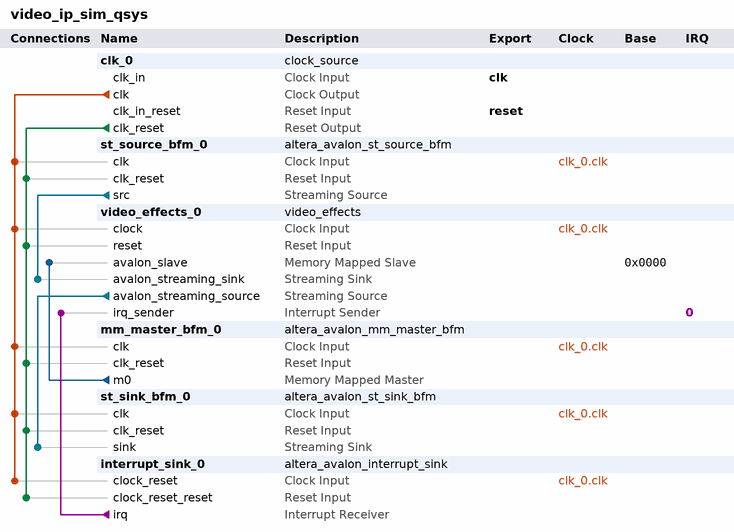
[diagram p0: system contents]
# Platform Designer (Qsys) system video_ip_sim_qsys, Cyclone IV E EP4CE115F29C7
# Parameters at their usual value, and those the tool derives, are not listed.
package require -exact qsys 17.1
create_system video_ip_sim_qsys
set_project_property DEVICE_FAMILY {Cyclone IV E}
set_project_property DEVICE EP4CE115F29C7

add_instance clk_0 clock_source 17.1
set_instance_parameter_value clk_0 clockFrequency 50000000

add_instance st_source_bfm_0 altera_avalon_st_source_bfm 17.1
set_instance_parameter_value st_source_bfm_0 ST_CHANNEL_W 1
set_instance_parameter_value st_source_bfm_0 ST_ERROR_W 1
set_instance_parameter_value st_source_bfm_0 ST_MAX_CHANNELS 0
set_instance_parameter_value st_source_bfm_0 ST_NUMSYMBOLS 1
set_instance_parameter_value st_source_bfm_0 ST_SYMBOL_W 16
set_instance_parameter_value st_source_bfm_0 USE_CHANNEL 0
set_instance_parameter_value st_source_bfm_0 USE_EMPTY 0
set_instance_parameter_value st_source_bfm_0 USE_ERROR 0
set_instance_parameter_value st_source_bfm_0 USE_PACKET 1
set_instance_parameter_value st_source_bfm_0 USE_READY 1
set_instance_parameter_value st_source_bfm_0 USE_VALID 1

add_instance video_effects_0 video_effects 0

add_instance mm_master_bfm_0 altera_avalon_mm_master_bfm 17.1
set_instance_parameter_value mm_master_bfm_0 ADDRESS_UNITS WORDS
set_instance_parameter_value mm_master_bfm_0 AV_ADDRESS_W 3
set_instance_parameter_value mm_master_bfm_0 AV_ALWAYS_BURST_MAX_BURST 0
set_instance_parameter_value mm_master_bfm_0 AV_BURSTCOUNT_W 1
set_instance_parameter_value mm_master_bfm_0 AV_BURST_BNDR_ONLY 0
set_instance_parameter_value mm_master_bfm_0 AV_BURST_LINEWRAP 0
set_instance_parameter_value mm_master_bfm_0 AV_CONSTANT_BURST_BEHAVIOR 0
set_instance_parameter_value mm_master_bfm_0 AV_FIX_READ_LATENCY 0
set_instance_parameter_value mm_master_bfm_0 AV_MAX_PENDING_WRITES 0
set_instance_parameter_value mm_master_bfm_0 AV_NUMSYMBOLS 4
set_instance_parameter_value mm_master_bfm_0 AV_READRESPONSE_W 8
set_instance_parameter_value mm_master_bfm_0 AV_READ_WAIT_TIME 1
set_instance_parameter_value mm_master_bfm_0 AV_WRITERESPONSE_W 8
set_instance_parameter_value mm_master_bfm_0 USE_BURSTCOUNT 0
set_instance_parameter_value mm_master_bfm_0 USE_BYTE_ENABLE 0
set_instance_parameter_value mm_master_bfm_0 USE_READ 1
set_instance_parameter_value mm_master_bfm_0 USE_READ_DATA 1
set_instance_parameter_value mm_master_bfm_0 USE_READ_DATA_VALID 0
set_instance_parameter_value mm_master_bfm_0 USE_WAIT_REQUEST 1
set_instance_parameter_value mm_master_bfm_0 VHDL_ID 0

add_instance st_sink_bfm_0 altera_avalon_st_sink_bfm 17.1
set_instance_parameter_value st_sink_bfm_0 ST_CHANNEL_W 1
set_instance_parameter_value st_sink_bfm_0 ST_ERROR_W 1
set_instance_parameter_value st_sink_bfm_0 ST_MAX_CHANNELS 0
set_instance_parameter_value st_sink_bfm_0 ST_NUMSYMBOLS 1
set_instance_parameter_value st_sink_bfm_0 ST_READY_LATENCY 0
set_instance_parameter_value st_sink_bfm_0 ST_SYMBOL_W 16
set_instance_parameter_value st_sink_bfm_0 USE_CHANNEL 0
set_instance_parameter_value st_sink_bfm_0 USE_EMPTY 0
set_instance_parameter_value st_sink_bfm_0 USE_ERROR 0
set_instance_parameter_value st_sink_bfm_0 USE_PACKET 1
set_instance_parameter_value st_sink_bfm_0 USE_READY 1
set_instance_parameter_value st_sink_bfm_0 USE_VALID 1
set_instance_parameter_value st_sink_bfm_0 VHDL_ID 0

add_instance interrupt_sink_0 altera_avalon_interrupt_sink 17.1
set_instance_parameter_value interrupt_sink_0 ASSERT_HIGH_IRQ 1
set_instance_parameter_value interrupt_sink_0 ASYNCHRONOUS_INTERRUPT 0
set_instance_parameter_value interrupt_sink_0 AV_IRQ_W 1
set_instance_parameter_value interrupt_sink_0 VHDL_ID 0

# connections
add_connection clk_0.clk interrupt_sink_0.clock_reset clock
add_connection clk_0.clk mm_master_bfm_0.clk clock
add_connection clk_0.clk st_sink_bfm_0.clk clock
add_connection clk_0.clk st_source_bfm_0.clk clock
add_connection clk_0.clk video_effects_0.clock clock
add_connection clk_0.clk_reset interrupt_sink_0.clock_reset_reset reset
add_connection clk_0.clk_reset mm_master_bfm_0.clk_reset reset
add_connection clk_0.clk_reset st_sink_bfm_0.clk_reset reset
add_connection clk_0.clk_reset st_source_bfm_0.clk_reset reset
add_connection clk_0.clk_reset video_effects_0.reset reset
add_connection mm_master_bfm_0.m0 video_effects_0.avalon_slave avalon
set_connection_parameter_value mm_master_bfm_0.m0/video_effects_0.avalon_slave baseAddress 0x0000
add_connection st_source_bfm_0.src video_effects_0.avalon_streaming_sink avalon_streaming
add_connection video_effects_0.avalon_streaming_source st_sink_bfm_0.sink avalon_streaming
add_connection interrupt_sink_0.irq video_effects_0.irq_sender interrupt
set_connection_parameter_value interrupt_sink_0.irq/video_effects_0.irq_sender irqNumber 0

# exported interfaces
add_interface clk clock sink
set_interface_property clk EXPORT_OF clk_0.clk_in
add_interface reset reset sink
set_interface_property reset EXPORT_OF clk_0.clk_in_reset

set_interconnect_requirement {$system} qsys_mm.clockCrossingAdapter HANDSHAKE
set_interconnect_requirement {$system} qsys_mm.enableEccProtection FALSE
set_interconnect_requirement {$system} qsys_mm.insertDefaultSlave FALSE
set_interconnect_requirement {$system} qsys_mm.maxAdditionalLatency 1

save_system video_ip_sim_qsys.qsys
